# EAGLE design detonador (EAGLE 8.2.2)
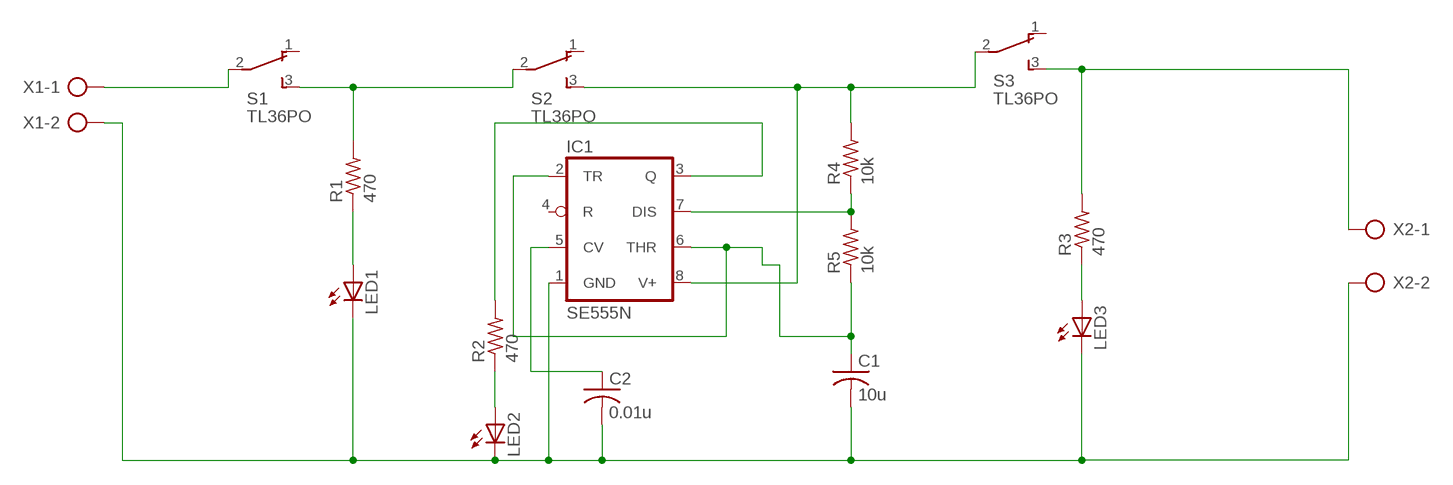
[diagram p0: schematic, sheet 1]

## Parts
C1  10u  C-US025-040X050  [C025-040X050]
C2  0.01u  C-US025-040X050  [C025-040X050]
IC1  SE555N  [DIL08-ROUND]
LED1  LED5MM  [LED5MM]
LED2  LED5MM  [LED5MM]
LED3  LED5MM  [LED5MM]
R1  470  R-US_0207/12  [0207/12]
R2  470  R-US_0207/12  [0207/12]
R3  470  R-US_0207/12  [0207/12]
R4  10k  R-US_0207/10  [0207/10]
R5  10k  R-US_0207/10  [0207/10]
S1  TL36PO  [TL3XPO]
S2  TL36PO  [TL3XPO]
S3  TL36PO  [TL3XPO]
X1  AK500/2-H  [AK500/2-H]
X2  AK500/2-H  [AK500/2-H]

## Nets
N$1: S1.2(P) X1.1
N$2: R1.2 S1.3(S) S2.2(P)
N$3: IC1.8(V+) R4.2 S2.3(S) S3.2(P)
N$4: LED1.A R1.1
N$5: LED2.A R2.1
N$6: C1.2 C2.2 IC1.1(GND) LED1.K(C) LED2.K(C) LED3.K(C) X1.2 X2.2
N$7: LED3.A R3.1
N$8: R3.2 S3.3(S) X2.1
N$9: IC1.3(Q) R2.2
N$10: C1.1 IC1.2(TR) IC1.6(THR) R5.1
N$11: C2.1 IC1.5(CV)
N$13: IC1.7(DIS) R4.1 R5.2
Unconnected: IC1.4(R) S1.1(O) S2.1(O) S3.1(O)

## Library data of the parts
C1 C2 = resistor:C-US: CAPACITOR, American symbol
IC1 = adafruit:*555: TIMER Changed DIP package to have round (not oval) pin pads http://www.ladyada.net/library/pcb/eaglelibrary.html
LED1-LED3 = led:LED: LED OSRAM: - CHIPLED LG R971, LG N971, LY N971, LG Q971, LY Q971, LO R971, LY R971 LH N974, LH R974 LS Q976, LO Q976, LY Q976 LO Q996 - Hyper CHIPLED LW Q18S LB Q993, LB Q99A, LB R99A - SideLED LS A670, LO A670, LY A670, LG A670, LP A670 LB A673, LV A673, LT A673, LW A673 LH A674 LY A675 LS A676, LA A676, LO A676, LY A676, LW A676 LS A679, LY A679, LG A679 - Hyper Micro SIDELED® LS Y876, LA Y876, LO Y876, LY Y876 LT Y87S - SmartLED LW L88C, LW L88S LB L89C, LB L89S, LG L890 LS L89K, LO L89K, LY L89K LS L896, LA L896, LO L896, LY L896 - TOPLED LS T670, LO T670, LY T670, LG T670, LP T670 LSG T670, LSP T670, LSY T670, LOP T670, LYG T670 LG T671, LOG T671, LSG T671 LB T673, LV T673, LT T673, LW T673 LH T674 LS T676, LA T676, LO T676, LY T676, LB T676, LH T676, LSB T676, LW T676 LB T67C, LV T67C, LT T67C, LS T67K, LO T67K, LY T67K, LW E67C LS E67B, LA E67B, LO E67B, LY E67B, LB E67C, LV E67C, LT E67C LW T67C LS T679, LY T679, LG T679 LS T770, LO T770, LY T770, LG T770, LP T770 LB T773, LV T773, LT T773, LW T773 LH T774 LS E675, LA E675, LY E675, LS T675 LS T776, LA T776, LO T776, LY T776, LB T776 LHGB T686 LT T68C, LB T68C - Hyper Mini TOPLED® LB M676 - Mini TOPLED Santana® LG M470 LS M47K, LO M47K, LY M47K Source: http://www.osram.convergy.de LUXEON: - LUMILED® LXK2-PW12-R00, LXK2-PW12-S00, LXK2-PW14-U00, LXK2-PW14-V00 LXK2-PM12-R00, LXK2-PM12-S00, LXK2-PM14-U00 LXK2-PE12-Q00, LXK2-PE12-R00, LXK2-PE12-S00, LXK2-PE14-T00, LXK2-PE14-U00 LXK2-PB12-K00, LXK2-PB12-L00, LXK2-PB12-M00, LXK2-PB14-N00, LXK2-PB14-P00, LXK2-PB14-Q00 LXK2-PR12-L00, LXK2-PR12-M00, LXK2-PR14-Q00, LXK2-PR14-R00 LXK2-PD12-Q00, LXK2-PD12-R00, LXK2-PD12-S00 LXK2-PH12-R00, LXK2-PH12-S00 LXK2-PL12-P00, LXK2-PL12-Q00, LXK2-PL12-R00 Source: www.luxeon.com KINGBRIGHT: KA-3528ASYC Source: www.kingbright.com
R1-R5 = rcl:R-US_: RESISTOR, American symbol
S1-S3 = switch:TL36PO: TINY SWITCH ON - ON Source: http://www2.produktinfo.conrad.com/datenblaetter/700000-724999/705152-da-01-de-Subminiaturschalter_TL_36YO.pdf
X1 X2 = con-ptr500:AK500/2-H: CONNECTOR Aug. 2004 / PTR Meßtechnik: Die Bezeichnung der Serie AK505 wurde geändert. Es handelt sich hierbei um AK500 in horizontaler Ausführung.; OC_FARNELL: unknown; OC_NEWARK: unknown

## Board
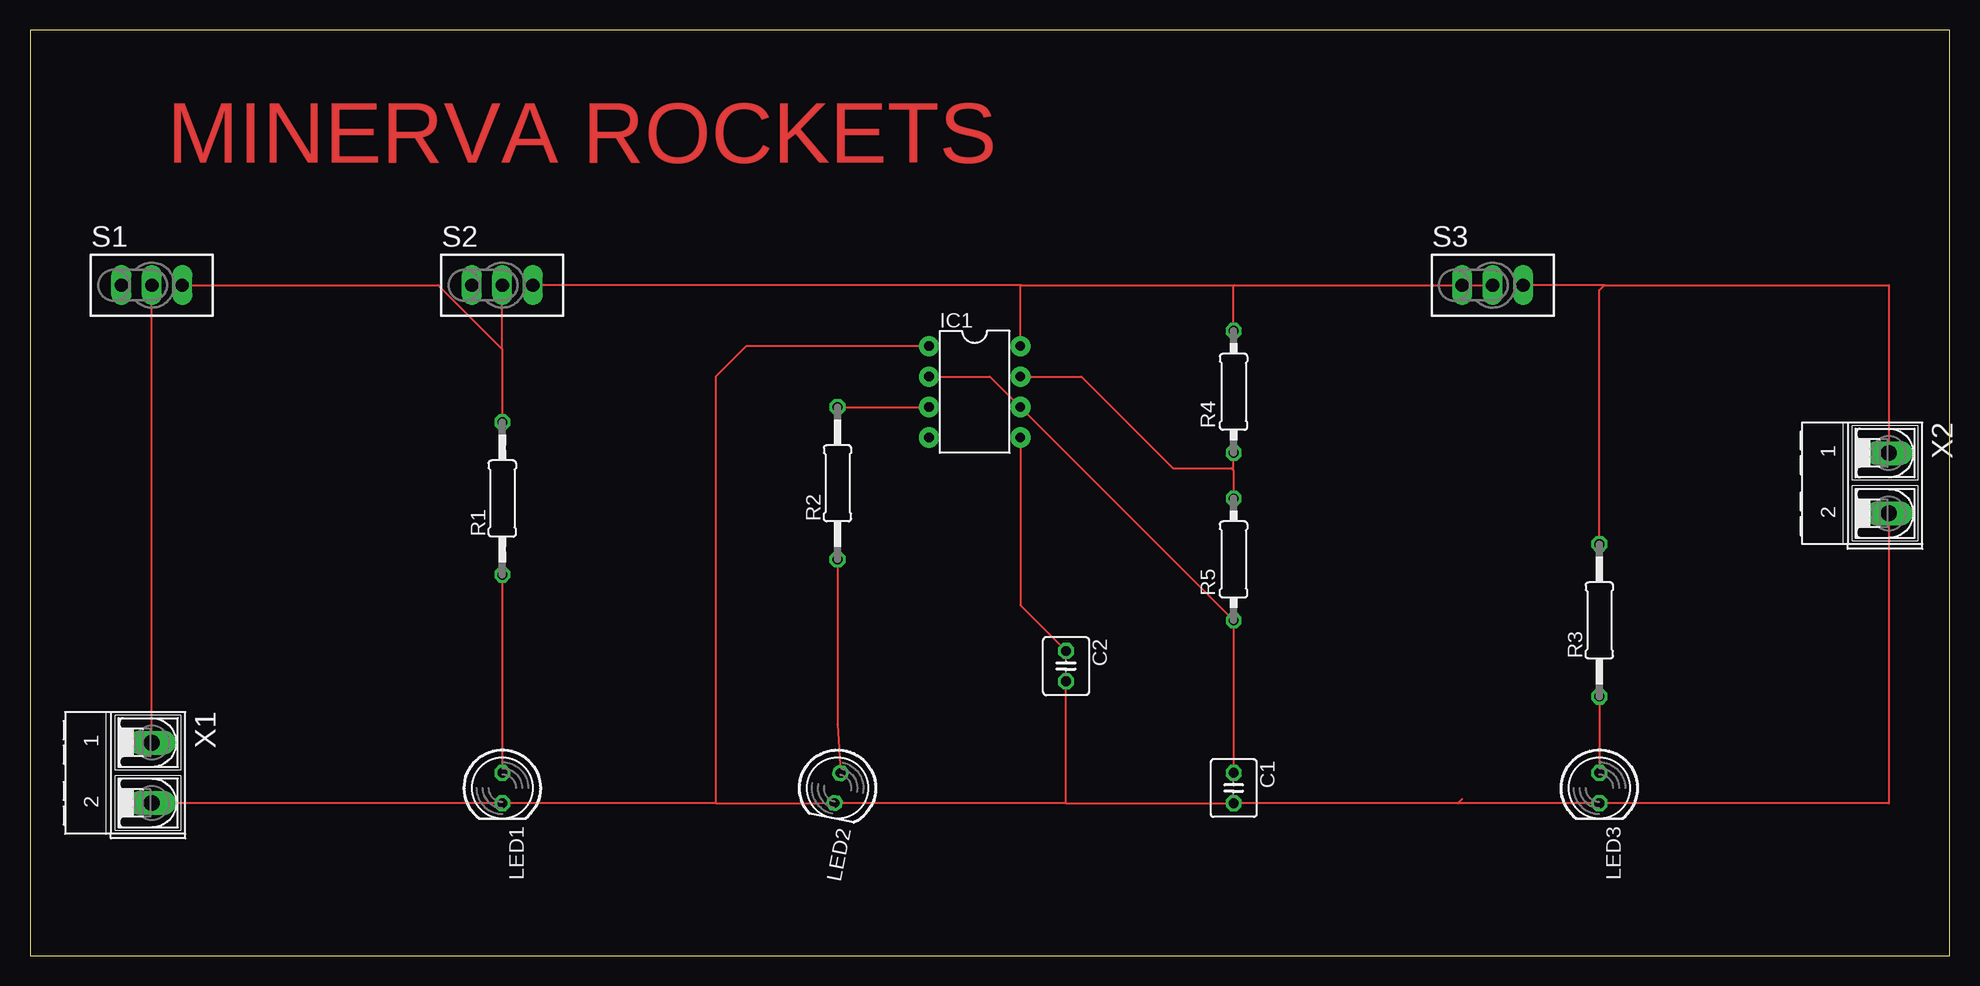
[diagram p1: board, top side]

Size 160 x 77.14 mm. Coordinates in mm from the lower left corner, seen from the top.
Outline: 0,0 160,0 160,77.14 0,77.14 0,0
Copper layers (1*16): Top 0.035mm / dielectric 1.5mm / Bottom 0.035mm
Design rules "default": minimum track width 6mil, minimum drill 0.35mm, track to track 6mil, track to pad 6mil, pad to pad 6mil, via to via 6mil, smd to smd 6mil, copper to edge 40mil, drill to drill 6mil, minimum pad ring 10mil, minimum via ring 8mil, stop-mask expansion 4mil, vias tented up to drill 0mil, thermal gap 10mil

### Footprints (pad centres in the part's own frame; a part is rotated, then mirrored left to right if it is on the bottom)
C025-040X050 = drill 0.813 octagon: 1 -1.27,0; 2 1.27,0
DIL08-ROUND = drill 0.813 pad 1.676: 1 -3.81,-3.81; 2 -1.27,-3.81; 3 1.27,-3.81; 4 3.81,-3.81; 5 3.81,3.81; 6 1.27,3.81; 7 -1.27,3.81; 8 -3.81,3.81
LED5MM = drill 0.813 octagon: A -1.27,0; K 1.27,0
0207/12 = drill 0.813 octagon: 1 -6.35,0; 2 6.35,0
0207/10 = drill 0.813 octagon: 1 -5.08,0; 2 5.08,0
TL3XPO = drill 1.1 pad 1.422 long: 1 -2.54,0; 2 0,0; 3 2.54,0
AK500/2-H = drill 1.321 long: 1 -2.515,0; 2 2.515,0

### Placement (x,y rotation side)
C1  100.33,13.97 270 top
C2  86.36,24.13 270 top
IC1  78.74,46.99 270 top
LED1  39.37,13.97 270 top
LED2  67.31,13.97 258.8 top
LED3  130.81,13.97 270 top
R1  39.37,38.1 90 top
R2  67.31,39.37 90 top
R3  130.81,27.94 90 top
R4  100.33,46.99 90 top
R5  100.33,33.02 90 top
S1  10.16,55.88 0 top
S2  39.37,55.88 0 top
S3  121.92,55.88 0 top
X1  10.16,15.24 270 top
X2  154.94,39.37 270 top

### Tracks (layer width: path | path; a pad name or v marks a point on that pad's centre or on a via)
N$1
  Top 0.152: X1.1 S1.2
N$2
  Top 0.152: 39.37,50.55 S2.2 | 39.37,50.55 R1.2 | S1.3 34.04,55.88 39.37,50.55
N$3
  Top 0.152: 82.63,55.88 S2.3 | 82.63,55.88 100.37,55.88 | 100.37,55.88 100.33,55.84 R4.2 | 82.63,55.88 82.55,55.8 IC1.8 | 100.37,55.88 S3.2
N$4
  Top 0.152: R1.1 LED1.A
N$5
  Top 0.152: R2.1 67.31,19.27 LED2.A
N$6
  Top 0.152: X1.2 39.34,12.72 LED1.K 57.19,12.7 | 57.19,12.7 65.77,12.7 LED2.K 86.34,12.72 86.36,12.7 | 86.36,12.7 C2.2 | 86.36,12.7 C1.2 119.02,12.7 | 119.02,12.7 LED3.K 154.94,12.7 X2.2 | 119.38,13.06 119.02,12.7 | IC1.1 59.69,50.8 57.15,48.26 57.15,12.74 57.19,12.7
N$7
  Top 0.152: R3.1 LED3.A
N$8
  Top 0.152: 131.23,55.88 S3.3 | 131.23,55.88 154.94,55.88 X2.1 | R3.2 130.81,55.46 131.23,55.88
N$9
  Top 0.152: R2.2 IC1.3
N$10
  Top 0.152: IC1.2 80.01,48.26 IC1.6 R5.1 C1.1
N$11
  Top 0.152: IC1.5 82.55,29.21 C2.1
N$13
  Top 0.152: 100.33,40.42 R4.1 | 100.33,40.42 R5.2 | IC1.7 87.63,48.26 95.25,40.64 100.11,40.64 100.33,40.42

### Text on the board
Top: MINERVA ROCKETS